# Altium schematic sheet Block Diagram.SchDoc
size A3; Engineer: Semih AŞÇI; SheetNumber: 1; SheetTotal: 3; PageSize: A3; ProjectDescription: Project Block Diagram; preparedBy: Semih AŞÇI; department: HW Design; RelaseDate: 22.12.2021; changedDate: 22.12.2021
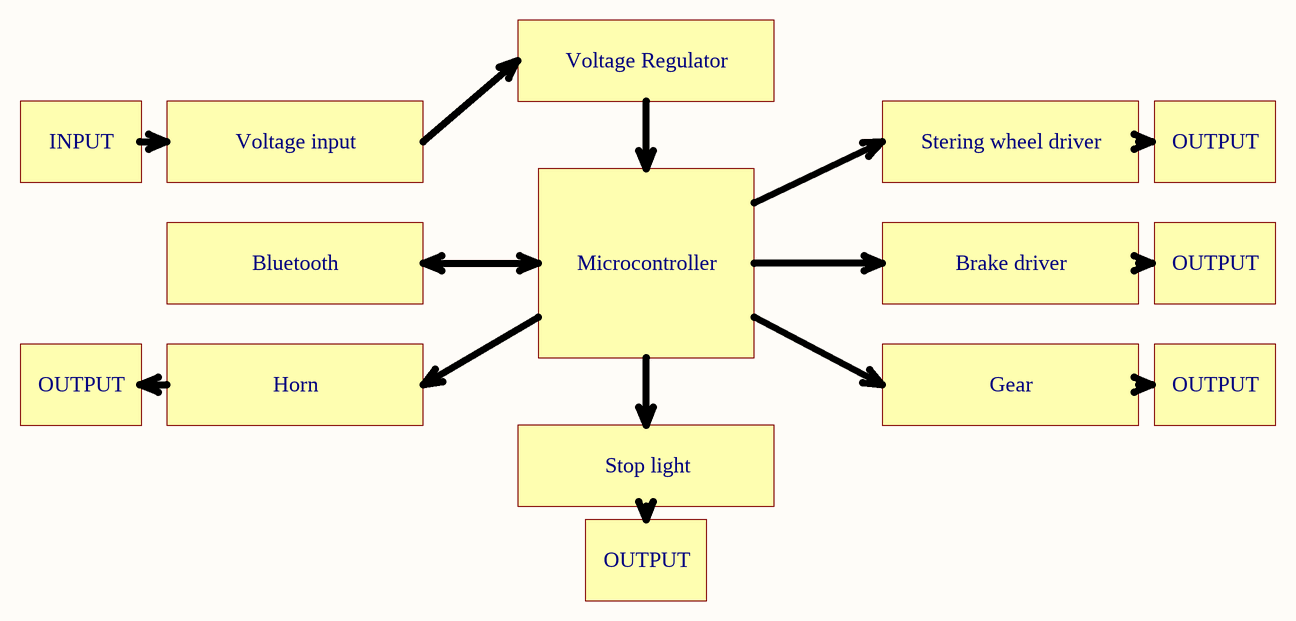
[diagram p0: Block Diagram.SchDoc]

## Notes on the sheet
- Voltage Regulator
- INPUT
- Voltage input
- Stering wheel driver
- OUTPUT
- Bluetooth
- Microcontroller
- Brake driver
- Horn
- Gear
- Stop light
- DOSYA ADI / FILE NAME
- TANIM/DESCRIPTION
- KONTROL EDEN/CHECKED BY
- HAZIRLAYAN/PREPARED BY
- DEĞ. TARİHİ/CHANGE DATE
- YAYIN TARİHİ/REL. DATE
- ONAYLAYAN/APPROVED BY
- BÖLÜM/DEPARTMENT
- BOYUT/SİZE
- REVİZYON/REVISION
- SAYFA/SHEET